# Altium schematic sheet Receiver_SCH.SchDoc: VX1 Pro Receiver
size A4; DrawnBy: Tim B; SheetNumber: 1; SheetTotal: 1
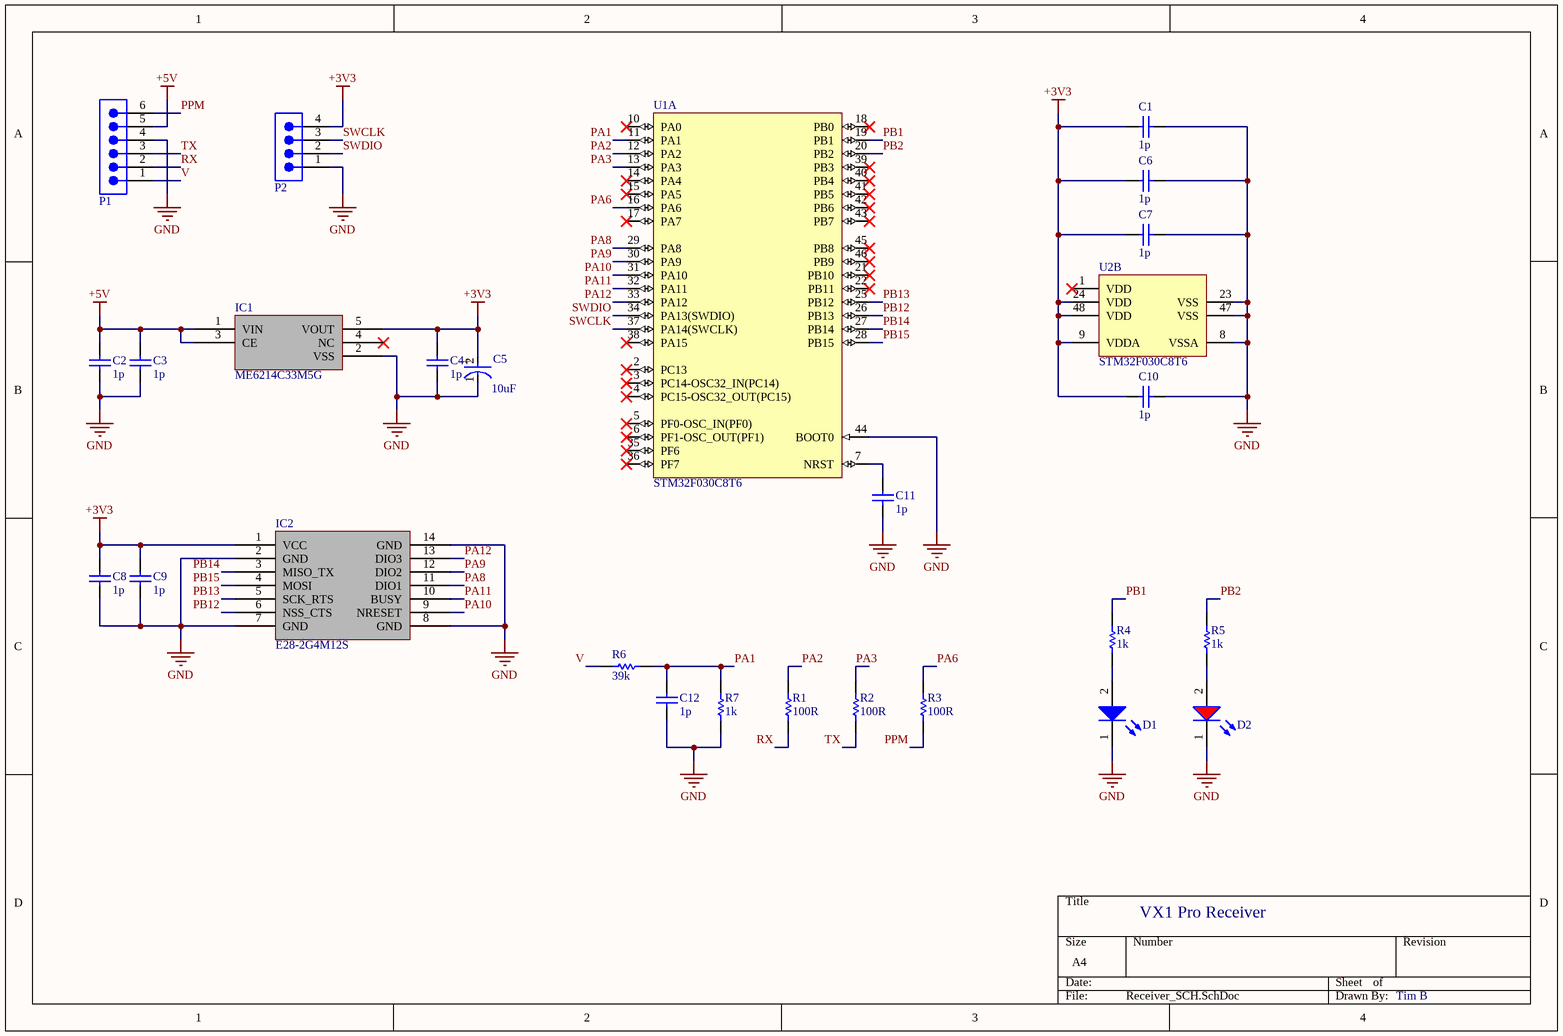
[diagram p0: Receiver_SCH.SchDoc]

## Parts
C1  value 1p  (hidden comment: Capacitor)
C2  value 1p  (hidden comment: Capacitor)
C3  value 1p  (hidden comment: Capacitor)
C4  value 1p  (hidden comment: Capacitor)
C5  Capacitance: 10uF  [FP-TAJB-MFG]  (hidden comment: TAJB106K016RNJ)
C6  value 1p  (hidden comment: Capacitor)
C7  value 1p  (hidden comment: Capacitor)
C8  value 1p  (hidden comment: Capacitor)
C9  value 1p  (hidden comment: Capacitor)
C10  value 1p  (hidden comment: Capacitor)
C11  value 1p  (hidden comment: Capacitor)
C12  value 1p  (hidden comment: Capacitor)
D1  150060BS75000  [WL-SMCW_0603_150060xx75000]  (value not drawn)
D2  150060SS75000  [WL-SMCW_0603_150060xx75000]  (value not drawn)
IC1  ME6214C33M5G  [MICRONE SOT-23-5]
IC2  E28-2G4M12S  [EBYTE E28-2G4M12S]
P1  61300611121  [61300611121]  (value not drawn)
P2  61300411121  [61300411121]  (value not drawn)
R1  Resistance: 100R  [RESC1005X40X25LL05T05]  (hidden comment: ERJ-2RKF1000X)
R2  Resistance: 100R  [RESC1005X40X25LL05T05]  (hidden comment: ERJ-2RKF1000X)
R3  Resistance: 100R  [RESC1005X40X25LL05T05]  (hidden comment: ERJ-2RKF1000X)
R4  value 1k  [RESC1005X40X20LL05T10]  (hidden comment: TNPW04021K00BETD)
R5  value 1k  [RESC1005X40X20LL05T10]  (hidden comment: TNPW04021K00BETD)
R6  value 39k  [RESC2013X70X40LL20T20]  (hidden comment: ERJ6ENF3902V)
R7  value 1k  [RESC1005X40X20LL05T10]  (hidden comment: TNPW04021K00BETD)
U1  STM32F030C8T6  [STM-LQFP48_M]  (part A of 2)
U2  STM32F030C8T6  [STM-LQFP48_M]  (part B of 2)

## Nets
+3V3: C1.2 C4.2 C5.2(A) C6.2 C7.2 C8.2 C9.2 C10.2 IC1.5(VOUT) IC2.1(VCC) P2.4 U2.9(VDDA) U2.24(VDD) U2.48(VDD)
+5V: C2.2 C3.2 IC1.1(VIN) IC1.3(CE) P1.5
GND: C1.1 C2.1 C3.1 C4.1 C5.1(C) C6.1 C7.1 C8.1 C9.1 C10.1 C11.1 C12.2 D1.1(K) D2.1(K) IC1.2(VSS) IC2.2(GND) IC2.7(GND) IC2.8(GND) IC2.14(GND) P1.4 P2.1 R7.1 U1.44(BOOT0) U2.8(VSSA) U2.23(VSS) U2.47(VSS)
PA1: C12.1 R6.2 R7.2 U1.11(PA1)
PA2: R1.2 U1.12(PA2)
PA3: R2.2 U1.13(PA3)
PA6: R3.2 U1.16(PA6)
PA8: IC2.11(DIO1) U1.29(PA8)
PA9: IC2.12(DIO2) U1.30(PA9)
PA10: IC2.9(NRESET) U1.31(PA10)
PA11: IC2.10(BUSY) U1.32(PA11)
PA12: IC2.13(DIO3) U1.33(PA12)
PB1: R4.2 U1.19(PB1)
PB2: R5.2 U1.20(PB2)
PB12: IC2.6(NSS_CTS) U1.26(PB13)
PB13: IC2.5(SCK_RTS) U1.25(PB12)
PB14: IC2.3(MISO_TX) U1.27(PB14)
PB15: IC2.4(MOSI) U1.28(PB15)
PPM: P1.6 R3.1
RX: P1.2 R1.1
SWCLK: P2.3 U1.37(PA14(SWCLK))
SWDIO: P2.2 U1.34(PA13(SWDIO))
TX: P1.3 R2.1
V: P1.1 R6.1
NetC11_2: C11.2 U1.7(NRST)
NetD1_2: D1.2(A) R4.1
NetD2_2: D2.2(A) R5.1

Not connected (* = marked no-connect by the designer): IC1 4(NC)*; U1 2(PC13)* 3(PC14-OSC32_IN(PC14))* 4(PC15-OSC32_OUT(PC15))* 5(PF0-OSC_IN(PF0))* 6(PF1-OSC_OUT(PF1))* 10(PA0)* 14(PA4)* 15(PA5)* 17(PA7)* 18(PB0)* 21(PB10)* 22(PB11)* 35(PF6)* 36(PF7)* 38(PA15)* 39(PB3)* 40(PB4)* 41(PB5)* 42(PB6)* 43(PB7)* 45(PB8)* 46(PB9)*; U2 1(VDD)*

## Notes on the sheet
- (in symbol CMP-2100-03688-2) +

## Library data of the parts
C1-C4 C6-C12 = Capacitor: SimulationGenericComponent: True
C5 = CMP-2100-03688-2: 10uF 16V  ±10% 2.8Ω 1210  SMD Tantalum Capacitor; Voltage: 10V; Polarity: Polar; ESR (Equivalent Series Resistance): 2.8R; Dissipation Factor: 6%; Leakage Current: 1.6uA; Case/Package: 1210; Features: General Purpose; Dielectric Material: Tantalum; Depth: 2.8mm; Lead Pitch: 1.4mm; Termination: SMD/SMT; Lead Free: Lead Free; Mount: Surface Mount; Series: TAJ; Tolerance: 10%; Construction: Flat; Length: 3.5mm; Case Code (Metric): 3528; Height: 1.9mm; Voltage Rating: 16V; Number of Pins: 2; Width: 0.11inch; Radiation Hardening: No; Case Code (Imperial): 1210; Max Operating Temperature: 125°C; RoHS Compliant: Yes; REACH SVHC: No SVHC; Package Quantity: 1; Height - Seated (Max): 0.083inch; Voltage Rating (DC): 16V; Min Operating Temperature: -55°C; Packaging: Tape and Reel
D1 = CMP-1426-00003-3: NexarPartId: 29717775; Luminous Intensity: 145mcd; Test Current: 20mA; Max Junction Temperature (Tj): 95°C; Max Reverse Voltage (DC): 5V; Dominant Wavelength: 470nm; Power Dissipation: 105mW; Peak Wavelength: 465nm; Forward Voltage: 3.2V; Viewing Angle: 140°; Color: Blue; Forward Current: 100mA; Lens Style: Clear, Rectangular; Mount: Surface Mount; Packaging: Tape and Reel; Min Operating Temperature: -40°C; Length: 1.6mm; Max Operating Temperature: 85°C; Width: 800µm; REACH SVHC: Unknown; Height: 700µm; Case Code (Imperial): 0603; RoHS: Compliant; Case/Package: 0603; Case Code (Metric): 1608; Wavelength: 470nm; Reverse Voltage: 5V
D2 = CMP-1426-00004-2: NexarPartId: 29717777; Wavelength: 630nm; Luminous Intensity: 60mcd; Max Reverse Voltage (DC): 5V; Peak Wavelength: 645nm; Forward Current: 100mA; Test Current: 20mA; Color: Red; Forward Voltage: 1.9V; Lens Style: Clear, Rectangular; Viewing Angle: 140°; Case/Package: 0603; Height: 700µm; REACH SVHC: Unknown; Case Code (Metric): 1608; Packaging: Tape and Reel; Min Operating Temperature: -40°C; Max Operating Temperature: 85°C; Case Code (Imperial): 0603; Dominant Wavelength: 630nm; Mount: Surface Mount; Length: 1.6mm; Width: 800µm; RoHS: Compliant
IC1 = MICRONE ME6214C33M5G
IC2 = Ebyte E28-2G4M12S
P1 = 61300611121: WR-PHD Pin Header, THT, Vertical, pitch 2.54mm, 1 Row, 6P; Manufacturer: Wurth Elektronik; Contact Resistance: 20mOhm; Rated Current: 3A; Working Voltage: 250V; Withstanding Voltage: 500V; Manufacturer Part Number: 61300611121; Category: Board-to-Board Connectors; Match Code: WR-PHD; ComponentLink1Description: Website Link; ComponentLink1URL: https://www.we-online.com/redexpert/article/61300611121?ad; ComponentLink2Description: Datasheet Link; ComponentLink2URL: https://www.we-online.com/redexpert/spec/61300611121?ad; Mount: Through Hole; Operating Temperature Max: 105°C; Operating Temperature Min: -40°C; Packaging: Bag; Gender: Pin Header; Number of Pins: 6; Number of Rows: 1; Orientation: Vertical; Pitch: 2.54mm
P2 = 61300411121: WR-PHD Pin Header, THT, Vertical, pitch 2.54mm, 1 Row, 4P; Manufacturer: Wurth Elektronik; Contact Resistance: 20mOhm; Rated Current: 3A; Working Voltage: 250V; Withstanding Voltage: 500V; Manufacturer Part Number: 61300411121; Category: Board-to-Board Connectors; Match Code: WR-PHD; ComponentLink1Description: Website Link; ComponentLink1URL: https://www.we-online.com/redexpert/article/61300411121?ad; ComponentLink2Description: Datasheet Link; ComponentLink2URL: https://www.we-online.com/redexpert/spec/61300411121?ad; Mount: Through Hole; Operating Temperature Max: 105°C; Operating Temperature Min: -40°C; Packaging: Bag; Gender: Pin Header; Number of Pins: 4; Number of Rows: 1; Orientation: Vertical; Pitch: 2.54mm
R1-R3 = CMP-2002-00605-3: Chip Resistor, 100 Ohm, +/- 1%, 100 mW, -55 to 155 degC, 0402 (1005 Metric), RoHS, Tape and Reel; Manufacturer: Basic Passives; Power Rating: 100 mW; Voltage Rating: 50 V; Case\/Package: 0402; Width: 0.5 mm; Pins: 2; ComponentLink2Description: Datasheet; PackageReference: 0402; Height: 0.35 mm; Tolerance: 1%; DatasheetVersion: 04/2015; Case Code (Imperial): 0402; Min Operating Temperature: -55 degC; Radiation Hardening: No; Length: 1 mm; Package Quantity: 10000; PackageDescription: 2-Pin Surface Mount Device, Body 1 x 0.5 mm; Mounting Technology: Surface Mount; Case Code (Metric): 1005; Packaging: Tape and Reel; ComponentLink1URL: http://www.panasonic.com/; RoHSCompliant: true; Max Operating Temperature: 155 degC; REACH SVHC: Yes; PartNumber: ERJ-2RKF1000X; ComponentLink1Description: Manufacturer URL; ComponentLink2URL: http://industrial.panasonic.com/cdbs/www-data/pdf/RDA0000/AOA0000C86.pdf; Mount: Surface Mount
R4 R5 R7 = CMP-2002-01704-1: Manufacturer: Vishay Dale; Part Number: TNPW04021K00BETD
R6 = CMP-2001-00542-1: Manufacturer: Panasonic; Part Number: ERJ6ENF3902V
U1 U2 = CMP-0304-00024-2: ARM Cortex-M0 32-bit MCU, 64 KB Flash, 8 KB Internal RAM, 39 I/Os, 48-pin LQFP, -40 to 85 degC, Tray; FLASH Size (Prog) (kB): 64; I/Os (High Current): 39; Operating Frequency(F) (Processor speed) (MHz): 48; Supply Voltage(Vcc) min (V): 2.4; Internal RAM Size (kB): 8; Packing: Tray; ComponentLink2URL: http://www.st.com/st-web-ui/static/active/en/resource/technical/document/datasheet/DM00088500.pdf; PackageVersion: Rev. 6, 06/2013; ComponentLink2Description: Datasheet; PartNumber: STM32F030C8T6; PackageDescription: 48-Pin Low Profile Quad Flat Package, 7 x 7 mm Body, 0.5 mm Pitch; Mounting Technology: Surface Mount; ComponentLink1URL: http://www.st.com/web/en/home.html; PackageReference: LQFP48; ComponentLink3URL: http://www.st.com/st-web-ui/static/active/en/resource/technical/document/datasheet/DM00058181.pdf; DatasheetVersion: Rev. 1; Core: ARM Cortex-M0; ComponentLink1Description: Manufacturer URL; ComponentLink3Description: Package Specification